# Altium schematic sheet main.SchDoc
size A4
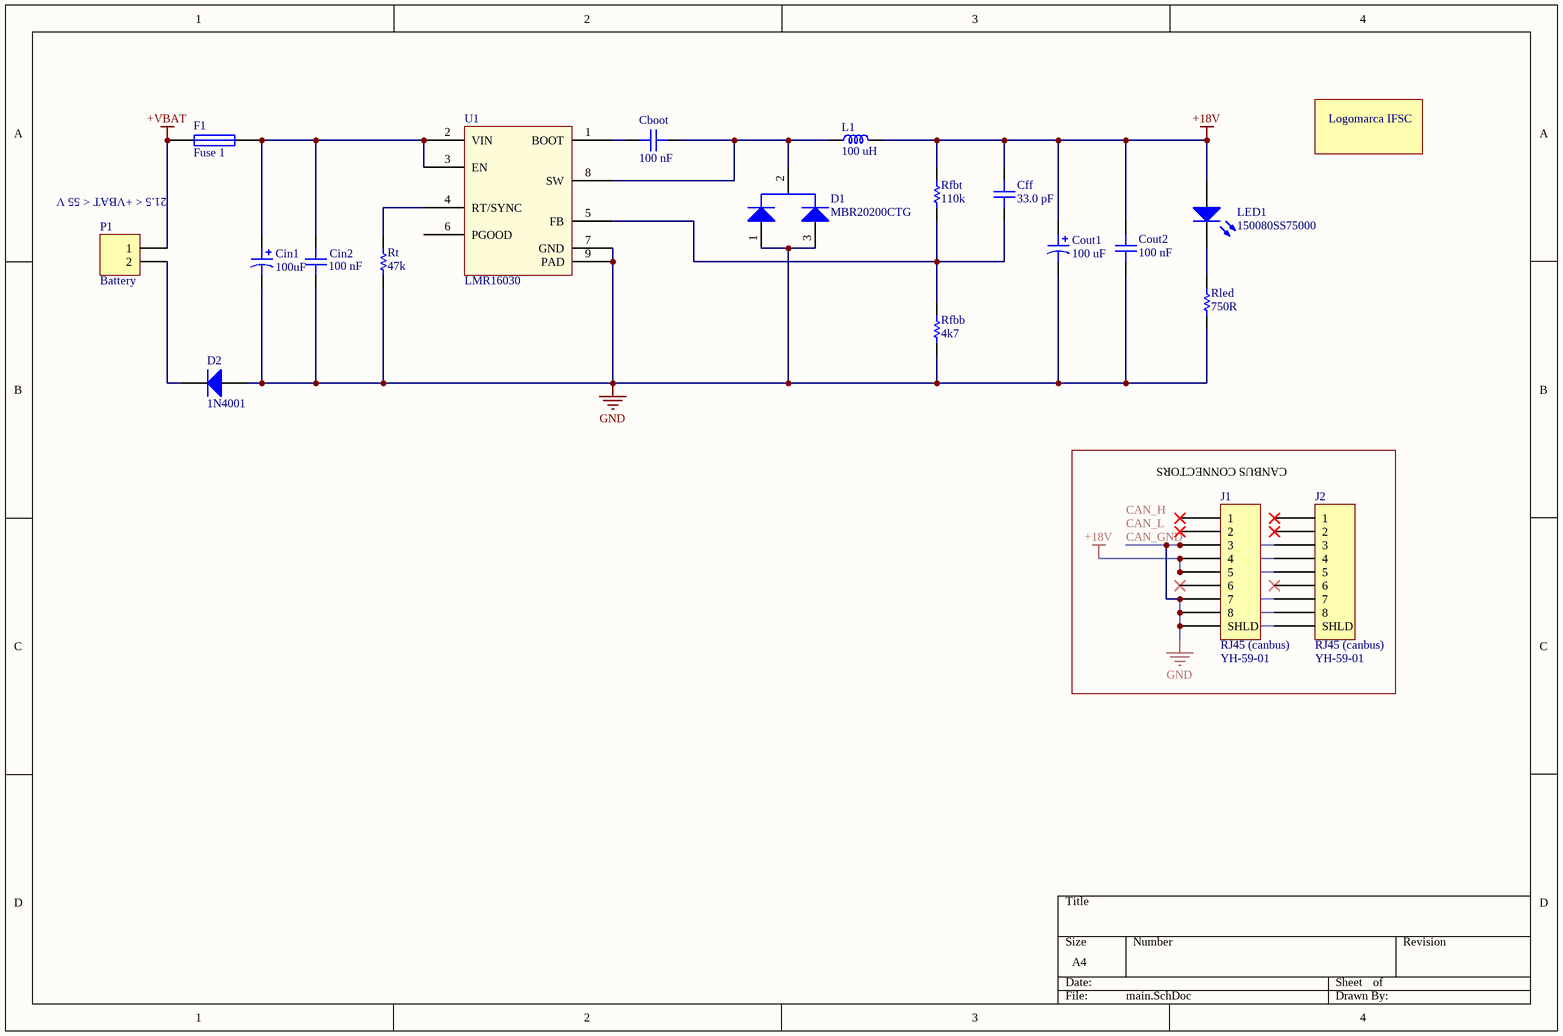
[diagram p0: main.SchDoc]

## Parts
Cboot  100 nF  [0805C]
Cff  33.0 pF  [0805C]
Cin1  100uF  [CP-RAD-12.5mm-35.0mm-5.0mm]
Cin2  100 nF  [0805C]
Cout1  100 uF  [CP-RAD-12.5mm-35.0mm-5.0mm]
Cout2  100 nF  [0805C]
D1  MBR20200CTG  [TO-220-deitado]
D2  1N4001  [DIO10.46-5.3x2.8]
F1  Fuse 1  [5x20]
J1  RJ45 (canbus)  value YH-59-01  [ASSMANN A-2004-2-4-LP/FS]
J2  RJ45 (canbus)  value YH-59-01  [ASSMANN A-2004-2-4-LP/FS]
L1  100 uH  [Toroldal D:20, H:10]
LED1  150080SS75000  [0805R]
P1  Battery  [KRE_2]
Rfbb  4k7  [0805R]
Rfbt  110k  [0805R]
Rled  750R  [0805R]
Rt  47k  [0805R]
U1  LMR16030  [lmr16030]
X1  Logomarca IFSC  [IFSC_SILK]  (value not drawn)

## Blocks framed on the sheet
CANBUS CONNECTORS: J1 J2

## Nets
+18V: Cff.2 Cout1.1 Cout2.1 J1.4 J1.5 J2.4 J2.5 L1.2 LED1.2(A) Rfbt.2
+VBAT: F1.1 P1.1
CAN_GND: Cin1.2 Cin2.2 Cout1.2 Cout2.2 D1.1(A1) D1.3(A2) D2.1(A) J1.3 J1.7 J1.8 J1.S(SHLD) J2.3 J2.7 J2.8 J2.S(SHLD) Rfbb.1 Rled.1 Rt.2 U1.7(GND) U1.9(PAD)  [also labelled GND]
NetCboot_1: Cboot.1 D1.2(K) L1.1 U1.8(SW)
NetCboot_2: Cboot.2 U1.1(BOOT)
NetCff_1: Cff.1 Rfbb.2 Rfbt.1 U1.5(FB)
NetCin1_1: Cin1.1 Cin2.1 F1.2 U1.2(VIN) U1.3(EN)
NetD2_2: D2.2(K) P1.2
NetLED1_1: LED1.1(K) Rled.2
NetRt_1: Rt.1 U1.4(RT/SYNC)

Not connected (* = marked no-connect by the designer): J1 1* 2* 6*; J2 1* 2* 6*; U1 6(PGOOD)

## Notes on the sheet
- 21.5 < +VBAT < 55 V
- Labels drawn without touching a wire or pin: CAN_H, CAN_L

## Library data of the parts
Cboot Cout2 = Capacitor: Voltage: 25 V; Published: 8-Jun-2000; LatestRevisionDate: 17-Jul-2002; LatestRevisionNote: Re-released for DXP Platform.; PackageReference: RAD-0.3; Publisher: Altium Limited
Cff = Capacitor: Voltage: 16 V; Published: 8-Jun-2000; LatestRevisionDate: 17-Jul-2002; LatestRevisionNote: Re-released for DXP Platform.; PackageReference: RAD-0.3; Publisher: Altium Limited
Cin1 = CapacitorPol: Solid Aluminum Capacitor with Organic Semiconductor Electrolyte: 100uF, 10V, Bulk Pack; Note: Part Numbers shown are for ± 20% capacitance tolerance (X0).; PCB_Layout: Complies with Manufacturer's Recommendation.; DrillSize: Nominal, Rounded to the nearest 0.1mm; Voltage: 100V; Published: 19-Mar-2004; DatasheetDocument: 29-Jun-2001; PackageReference: E; Publisher: Altium Limited; ComponentLink1Description: Manufacturer Link; ComponentLink1URL: http://www.vishay.com/; ComponentLink2Description: Datasheet; ComponentLink2URL: http://www.vishay.com/docs/90003/94sa.pdf
Cin2 = Capacitor: Voltage: 100 V; Published: 8-Jun-2000; LatestRevisionDate: 17-Jul-2002; LatestRevisionNote: Re-released for DXP Platform.; PackageReference: RAD-0.3; Publisher: Altium Limited
Cout1 = CapacitorPol: Solid Aluminum Capacitor with Organic Semiconductor Electrolyte: 100uF, 10V, Bulk Pack; Note: Part Numbers shown are for ± 20% capacitance tolerance (X0).; PCB_Layout: Complies with Manufacturer's Recommendation.; DrillSize: Nominal, Rounded to the nearest 0.1mm; Voltage: 25 V; Published: 19-Mar-2004; DatasheetDocument: 29-Jun-2001; PackageReference: E; Publisher: Altium Limited; ComponentLink1Description: Manufacturer Link; ComponentLink1URL: http://www.vishay.com/; ComponentLink2Description: Datasheet; ComponentLink2URL: http://www.vishay.com/docs/90003/94sa.pdf
D1 = CMP-1051-00023-1: SWITCHMODE(TM) Power Rectifier, Dual Schottky Rectifiers, 3-Pin TO-220, Pb-Free, Tube; Manufacturer: On Semiconductor; IFSM Max (A): 150; Configuration: Common Cathode; DatasheetVersion: Rev. 9; ComponentLink3URL: http://www.onsemi.cn/pub_link/Collateral/MCR8S-D.PDF; RoHS: TRUE; PackageReference: TO-220-3-221A-09_AF; Mounting Technology: Through Hole; PackageVersion: Rev. AF; ComponentLink1Description: Manufacturer URL; ComponentLink1URL: http://www.onsemi.com/; ComponentLink2URL: http://www.onsemi.cn/pub_link/Collateral/MBR20200CT-D.PDF; ComponentLink2Description: Datasheet; PackageDescription: 3-Pin Flange Mount, Vertical Straight Lead, Body 9.97 x 4.445 mm, Pitch 2.54 mm; ComponentLink3Description: Package Specification; Packing: Tube; PartNumber: MBR20200CTG
D2 = Diode 1N4001: 1 Amp General Purpose Rectifier; Published: 8-Jun-2000; LatestRevisionDate: 17-Jul-2002; LatestRevisionNote: Re-released for DXP Platform.; DatasheetVersion: 1998; PackageVersion: Aug-1999; PackageReference: DO-41; Publisher: Altium Limited; Code_JEDEC: DO-204-AL; ComponentLink1Description: Manufacturer Link; ComponentLink1URL: http://www.fairchildsemi.com/; ComponentLink2Description: Datasheet; ComponentLink2URL: http://www.fairchildsemi.com/ds/1N%2F1N4001.pdf
F1 = Fuse 1: Fuse; Published: 8-Jun-2000; LatestRevisionDate: 17-Jul-2002; LatestRevisionNote: Re-released for DXP Platform.; PackageReference: PIN-W2/E2.8; Publisher: Altium Limited
J1 J2 = Modular Jack with Shield: YH-59-01
L1 = Inductor
LED1 = CMP-1426-00010-1: SMD mono-color Chip LED, WL-SMCW, Super Red; Manufacturer: Wuerth Elektronik; PackageReference: 0805_A; ComponentLink2URL: http://katalog.we-online.com/led/datasheet/150080SS75000.pdf; ComponentLink1URL: http://www.we-online.com; Color: Super Red; ComponentLink2Description: Datasheet; ComponentLink1Description: Manufacturer URL; PartNumber: 150080SS75000
P1 = KRE_2: Terminal Block 1x2
Rfbb Rfbt Rled Rt = Resistor: Power: 1/8 W; Tolerance: 5%; Published: 8-Jun-2000; LatestRevisionDate: 17-Jul-2002; LatestRevisionNote: Re-released for DXP Platform.; PackageReference: AXIAL-0.3; Publisher: Altium Limited
U1 = Component_1
X1 = logomarcaIFSC